# Altium schematic sheet OutputStage.SchDoc
size A3; SheetNumber: 2; SheetTotal: 5
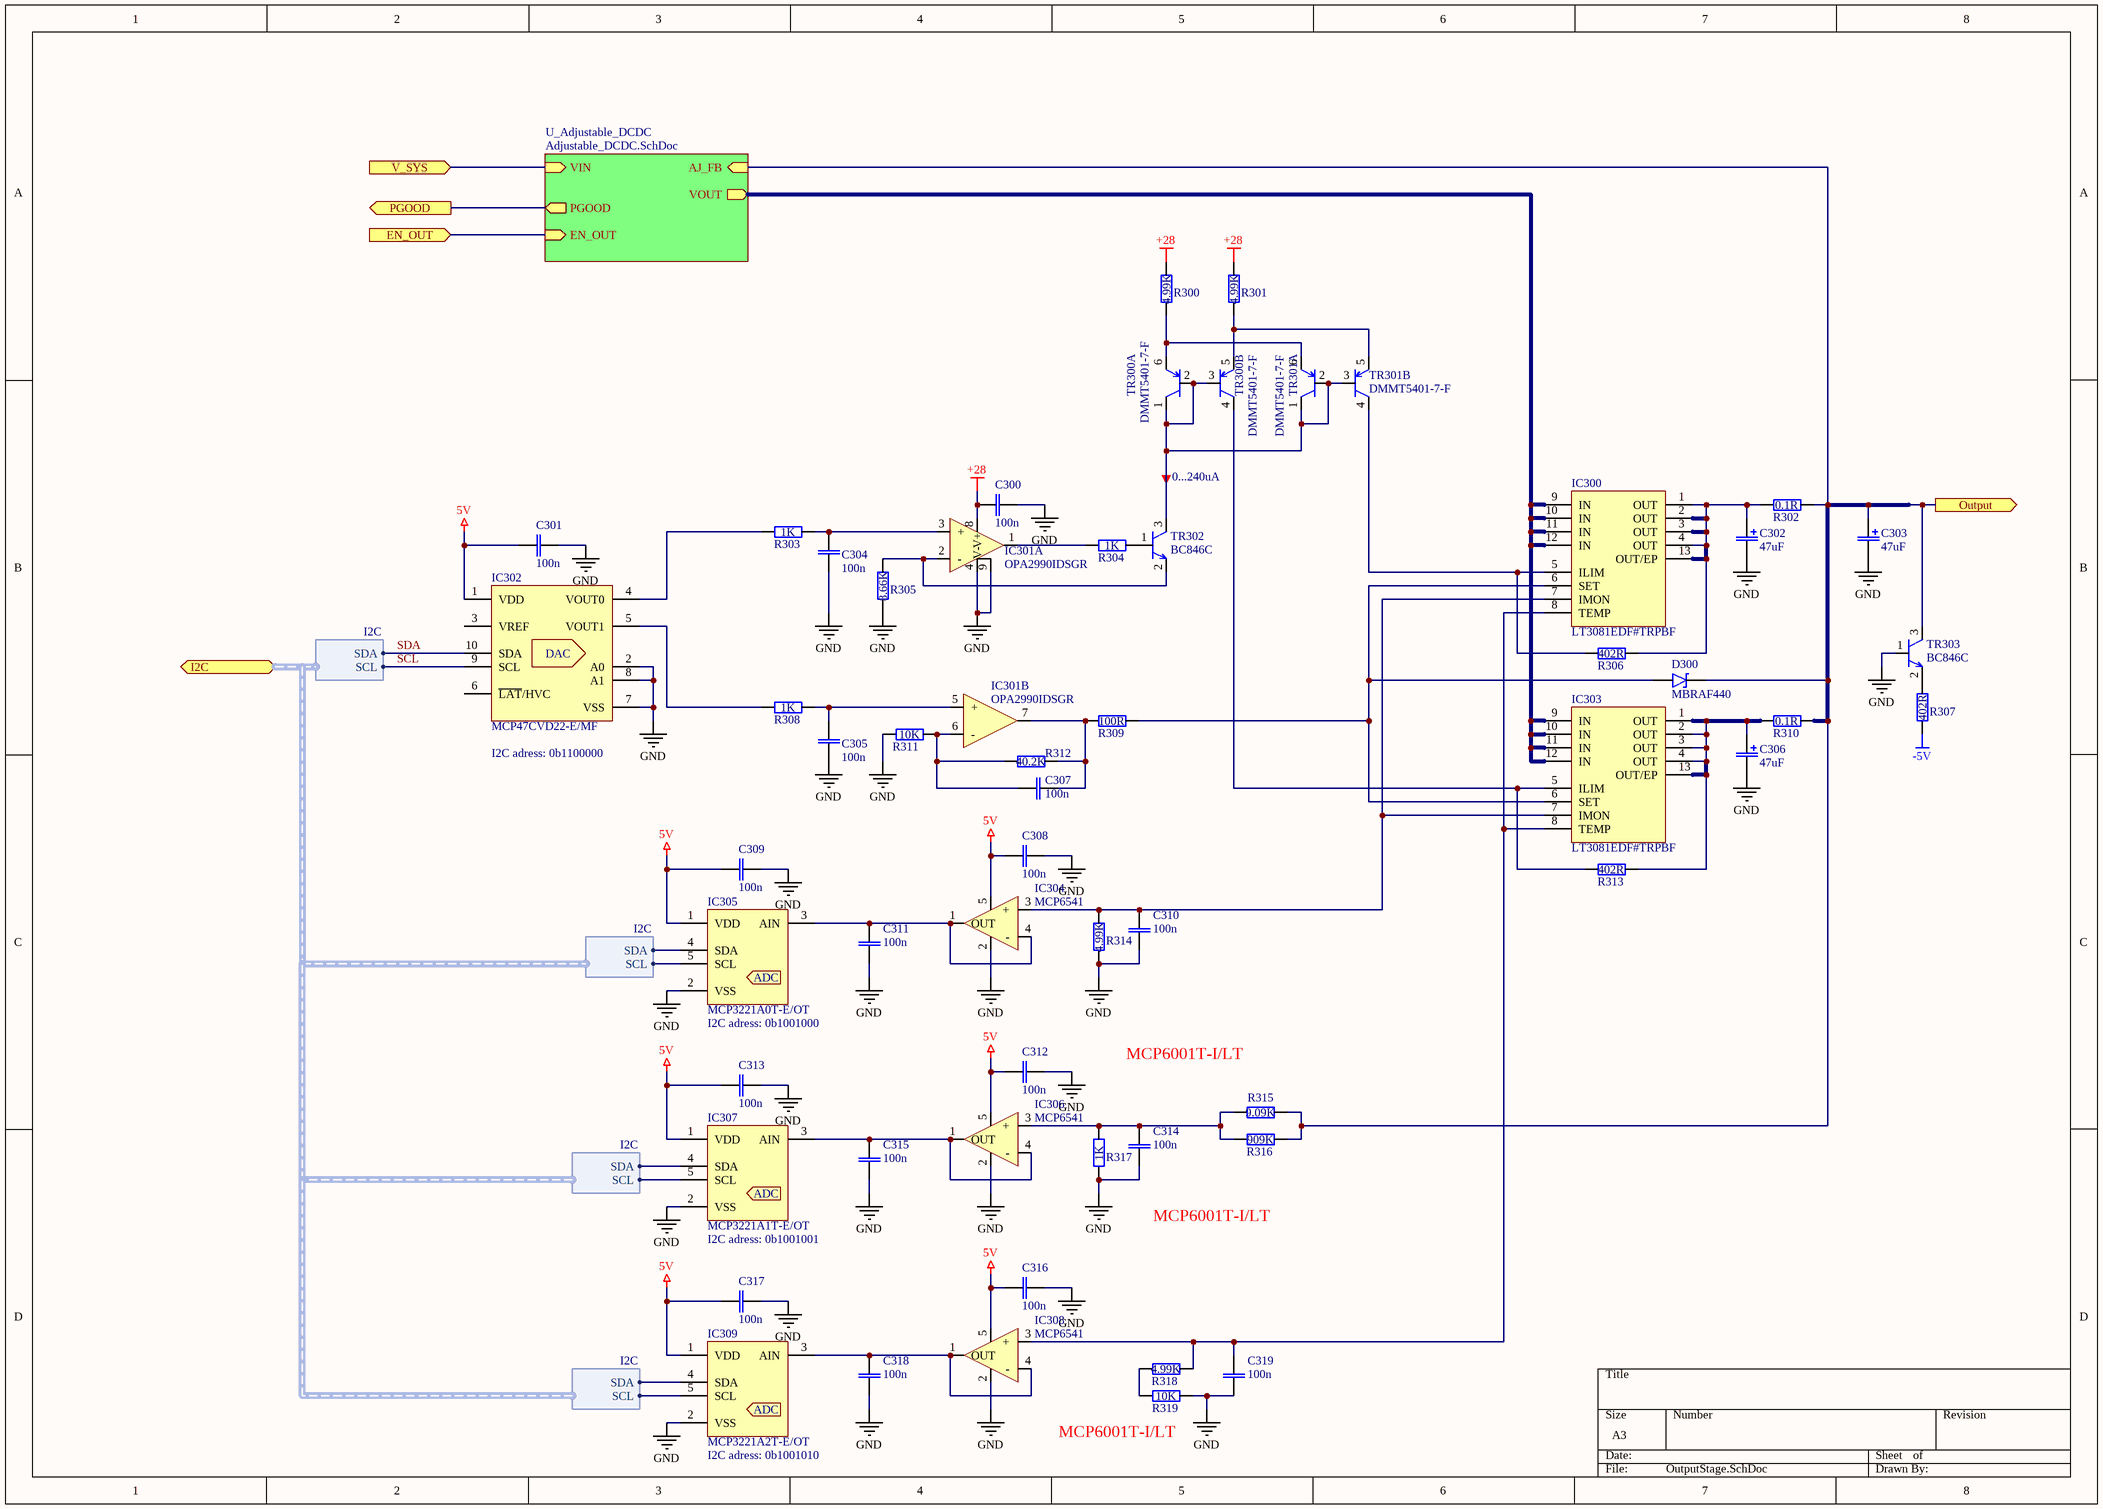
[diagram p0: OutputStage.SchDoc]

## Parts
C300  100n  [CAP0402]
C301  100n  [CAP0402]
C302  47uF  [CHEMICON_KOND_D8H10]
C303  47uF  [CHEMICON_KOND_D8H10]
C304  100n  [CAP0402]
C305  100n  [CAP0402]
C306  47uF  [CHEMICON_KOND_D8H10]
C307  100n  [CAP0402]
C308  100n  [CAP0402]
C309  100n  [CAP0402]
C310  100n  [CAP0402]
C311  100n  [CAP0402]
C312  100n  [CAP0402]
C313  100n  [CAP0402]
C314  100n  [CAP0402]
C315  100n  [CAP0402]
C316  100n  [CAP0402]
C317  100n  [CAP0402]
C318  100n  [CAP0402]
C319  100n  [CAP0402]
D300  MBRAF440  [SMAF]
IC300  LT3081EDF#TRPBF  [WSON12_4X4(LT3081)]
IC301  OPA2990IDSGR  [WSON8(DRV8210)]  (parts A,B of 2)
IC302  MCP47CVD22-E/MF  [WSON10(MCP47CXDX1/2)]
IC303  LT3081EDF#TRPBF  [WSON12_4X4(LT3081)]
IC304  MCP6541  [SOT353/SC-70-5(MCP6541)]
IC305  MCP3221A0T-E/OT  [SOT23-5(MCP73831)]
IC306  MCP6541  [SOT353/SC-70-5(MCP6541)]
IC307  MCP3221A1T-E/OT  [SOT23-5(MCP73831)]
IC308  MCP6541  [SOT353/SC-70-5(MCP6541)]
IC309  MCP3221A2T-E/OT  [SOT23-5(MCP73831)]
R300  RC0402FR-074K99L  [RES0402]  (value not drawn)
R301  RC0402FR-074K99L  [RES0402]  (value not drawn)
R302  RCWE1210R100FKEA  [RES1210]  (value not drawn)
R303  RC0402FR-071KL  [RES0402]  (value not drawn)
R304  RC0402FR-071KL  [RES0402]  (value not drawn)
R305  RC0402FR-078K66L  [RES0402]  (value not drawn)
R306  RC0402FR-07402RL  [RES0402]  (value not drawn)
R307  RC0402FR-07402RL  [RES0402]  (value not drawn)
R308  RC0402FR-071KL  [RES0402]  (value not drawn)
R309  RC0402FR-07100RL  [RES0402]  (value not drawn)
R310  RCWE1210R100FKEA  [RES1210]  (value not drawn)
R311  10K  [RES0402]  (value not drawn)
R312  RC0402FR-0740K2L  [RES0402]  (value not drawn)
R313  RC0402FR-07402RL  [RES0402]  (value not drawn)
R314  RC0402FR-074K99L  [RES0402]  (value not drawn)
R315  RC0402FR-079K09L  [RES0402]  (value not drawn)
R316  RC0402FR-07909KL  [RES0402]  (value not drawn)
R317  RC0402FR-071KL  [RES0402]  (value not drawn)
R318  RC0402FR-074K99L  [RES0402]  (value not drawn)
R319  10K  [RES0402]  (value not drawn)
TR300  DMMT5401-7-F  [SOT95P245X120-6N]  (parts A,B of 2)
TR301  DMMT5401-7-F  [SOT95P245X120-6N]  (parts A,B of 2)
TR302  BC846C  [SOT23(IRLM2244T)]
TR303  BC846C  [SOT23(IRLM2244T)]

## Sub-sheets
U_Adjustable_DCDC = Adjustable_DCDC.SchDoc: EN_OUT (in), PGOOD (out), AJ_FB (in), VIN (in), VOUT (out)

## Ports
EN_OUT (in, see Overview[3B], Adjustable_DCDC[3B]), I2C (bidir, harness I2C, see Overview[3B]), Output (out, see Overview[4B]), PGOOD (out, see Overview[3B], Adjustable_DCDC[3B]), V_SYS (in, see Overview[3B], DCDC_Converter[1A])

## Harnesses
I2C: SDA, SCL

## Nets
5V: C301.2 C308.2 C309.2 C312.2 C313.2 C316.2 C317.2 IC302.1(VDD) IC304.5(VDD) IC305.1(VDD) IC306.5(VDD) IC307.1(VDD) IC308.5(VDD) IC309.1(VDD)
+28: C300.2 IC301.8(V+) R300.2 R301.2
-5V: R307.1
GND: C300.1 C301.1 C302.2 C303.2 C304.2 C305.2 C306.2 C308.1 C309.1 C310.1 C311.1 C312.1 C313.1 C314.1 C315.1 C316.1 C317.1 C318.1 C319.1 IC301.4(V-) IC301.9(EP) IC302.2(A0) IC302.7(VSS) IC302.8(A1) IC304.2(VSS) IC305.2(VSS) IC306.2(VSS) IC307.2(VSS) IC308.2(VSS) IC309.2(VSS) R305.1 R311.1 R314.1 R317.1 R319.2 TR303.1(B)
EN_OUT: port EN_OUT, sheet U_Adjustable_DCDC/EN_OUT
Output: C303.1 D300.1 R302.2 R310.2 R315.2 R316.2 TR303.3(C) ; port Output, sheet U_Adjustable_DCDC/AJ_FB
PGOOD: port PGOOD, sheet U_Adjustable_DCDC/PGOOD
SCL: IC302.9(SCL) IC305.5(SCL) IC307.5(SCL) IC309.5(SCL) ; port I2C.SCL
SDA: IC302.10(SDA) IC305.4(SDA) IC307.4(SDA) IC309.4(SDA) ; port I2C.SDA
V_SYS: port V_SYS, sheet U_Adjustable_DCDC/VIN
NetC302_1: C302.1 IC300.1(OUT) IC300.2(OUT) IC300.3(OUT) IC300.4(OUT) IC300.13(OUT/EP) R302.1 R306.2
NetC304_1: C304.1 IC301.3(+) R303.2
NetC305_1: C305.1 IC301.5(+) R308.2
NetC306_1: C306.1 IC303.1(OUT) IC303.2(OUT) IC303.3(OUT) IC303.4(OUT) IC303.13(OUT/EP) R310.1 R313.2
NetC307_1: C307.1 IC301.7(OUT) R309.1 R312.2
NetC307_2: C307.2 IC301.6(-) R311.2 R312.1
NetC310_2: C310.2 IC300.7(IMON) IC303.7(IMON) IC304.3(+) R314.2
NetC311_2: C311.2 IC304.1(OUT) IC304.4(-) IC305.3(AIN)
NetC314_2: C314.2 IC306.3(+) R315.1 R316.1 R317.2
NetC315_2: C315.2 IC306.1(OUT) IC306.4(-) IC307.3(AIN)
NetC318_2: C318.2 IC308.1(OUT) IC308.4(-) IC309.3(AIN)
NetC319_2: C319.2 IC300.8(TEMP) IC303.8(TEMP) IC308.3(+) R318.2
NetD300_2: D300.2 IC300.6(SET) IC303.6(SET) R309.2
NetIC300_5: IC300.5(ILIM) R306.1 TR301.4(C)
NetIC300_9: IC300.9(IN) IC300.10(IN) IC300.11(IN) IC300.12(IN) IC303.9(IN) IC303.10(IN) IC303.11(IN) IC303.12(IN) ; sheet U_Adjustable_DCDC/VOUT
NetIC301_1: IC301.1(OUT) R304.1
NetIC301_2: IC301.2(-) R305.2 TR302.2(E)
NetIC302_4: IC302.4(VOUT0) R303.1
NetIC302_5: IC302.5(VOUT1) R308.1
NetIC303_5: IC303.5(ILIM) R313.1 TR300.4(C)
NetR300_1: R300.1 TR300.6(E) TR301.6(E)
NetR301_1: R301.1 TR300.5(E) TR301.5(E)
NetR304_2: R304.2 TR302.1(B)
NetR307_2: R307.2 TR303.2(E)
NetR318_1: R318.1 R319.1
NetTR300_1: TR300.1(C) TR300.2(B) TR300.3(B) TR301.1(C) TR301.2(B) TR301.3(B) TR302.3(C)

Not connected (* = marked no-connect by the designer): IC302 3(VREF) 6(~{LAT}/HVC)

## Notes on the sheet
- 0...240uA
- (near IC302) I2C adress: 0b1100000
- (near IC305) I2C adress: 0b1001000
- MCP6001T-I/LT
- (near IC307) I2C adress: 0b1001001
- (near IC309) I2C adress: 0b1001010
- (near R319) MCP6001T-I/LT
- (in symbol MCP47CVD22-E/MF) DAC
- (in symbol MCP3221A0T-E/OT) ADC
- (in symbol MCP3221A1T-E/OT) ADC
- (in symbol MCP3221A2T-E/OT) ADC

## Library data of the parts
C300 C301 C304 C305 C307-C319 = CL05A104KA5NNNC: MaxVoltage: 25V; Dialectric: X5R; Tolerance: 10%; Value: 100n; MPN: CL05A104KA5NNNC
C302 C303 C306 = HHXC500ARA470MHA0G: MaxVoltage: 50V; Value: 47uF; MPN: HHXC500ARA470MHA0G
IC301 = OPA2990IDSGR: Replacment for LM358D; ComponentLink1Description: Datasheet; ComponentLink1URL: https://www.ti.com/lit/ds/symlink/opa2990.pdf?HQS=dis-dk-null-digikeymode-dsf-pf-null-wwe&ts=1774018374396&ref_url=https%253A%252F%252Fwww.ti.com%252Fgeneral%252Fdocs%252Fsuppproductinfo.tsp%253FdistId%253D10%2526gotoUrl%253Dhttps%253A%252F%252Fwww.ti.com%252Flit%252Fgpn%252Fopa2990; MPN: OPA2990IDSGR
IC304 IC306 IC308 = MCP6541: MPN: MCP6541UT-I/LT
R300 R301 R314 R318 = RC0402FR-074K99L: Value: 4.99K; MPN: RC0402FR-074K99L
R302 R310 = RCWE1210R100FKEA: Value: 0.1R; MPN: RCWE1210R100FKEA
R303 R304 R308 R317 = RC0402FR-071KL: Value: 1K; MPN: RC0402FR-071KL
R305 = RC0402FR-078K66L: Value: 8.66K; MPN: RC0402FR-078K66L
R306 R307 R313 = RC0402FR-07402RL: Value: 402R; MPN: RC0402FR-07402RL
R309 = RC0402FR-07100RL: Value: 100R; MPN: RC0402FR-07100RL
R311 R319 = RC0402JR-0710KL: Power: 0.063W; Tolerance: 5%; Value: 10K; MPN: RC0402JR-0710KL
R312 = RC0402FR-0740K2L: Value: 40.2K; MPN: RC0402FR-0740K2L
R315 = RC0402FR-079K09L: Value: 9.09K; MPN: RC0402FR-079K09L
R316 = RC0402FR-07909KL: Value: 909K; MPN: RC0402FR-07909KL
D300 = MBRAF440: Part Number: MBRAF440; Component Type: Standard; Value: MBRAF440; Digikey Number: MBRAF440T3GOSCT-ND; MPN: MBRAF440
IC300 IC303 = LT3081EDF#TRPBF: MPN: LT3081EDF#TRPBF
IC302 = MCP47CVD22-E/MF: MPN: MCP47CVD22-E/MF
IC305 = MCP3221A0T-E/OT: MPN: MCP3221A0T-E/OT
IC307 = MCP3221A1T-E/OT: MPN: MCP3221A1T-E/OT
IC309 = MCP3221A2T-E/OT: MPN: MCP3221A2T-E/OT
TR300 TR301 = DMMT5401-7-F: MPN: DMMT5401-7-F
TR302 TR303 = BC846C: MPN: BC846C